# Altium schematic sheet CH32M030C8T7_1V3.SchDoc
size C
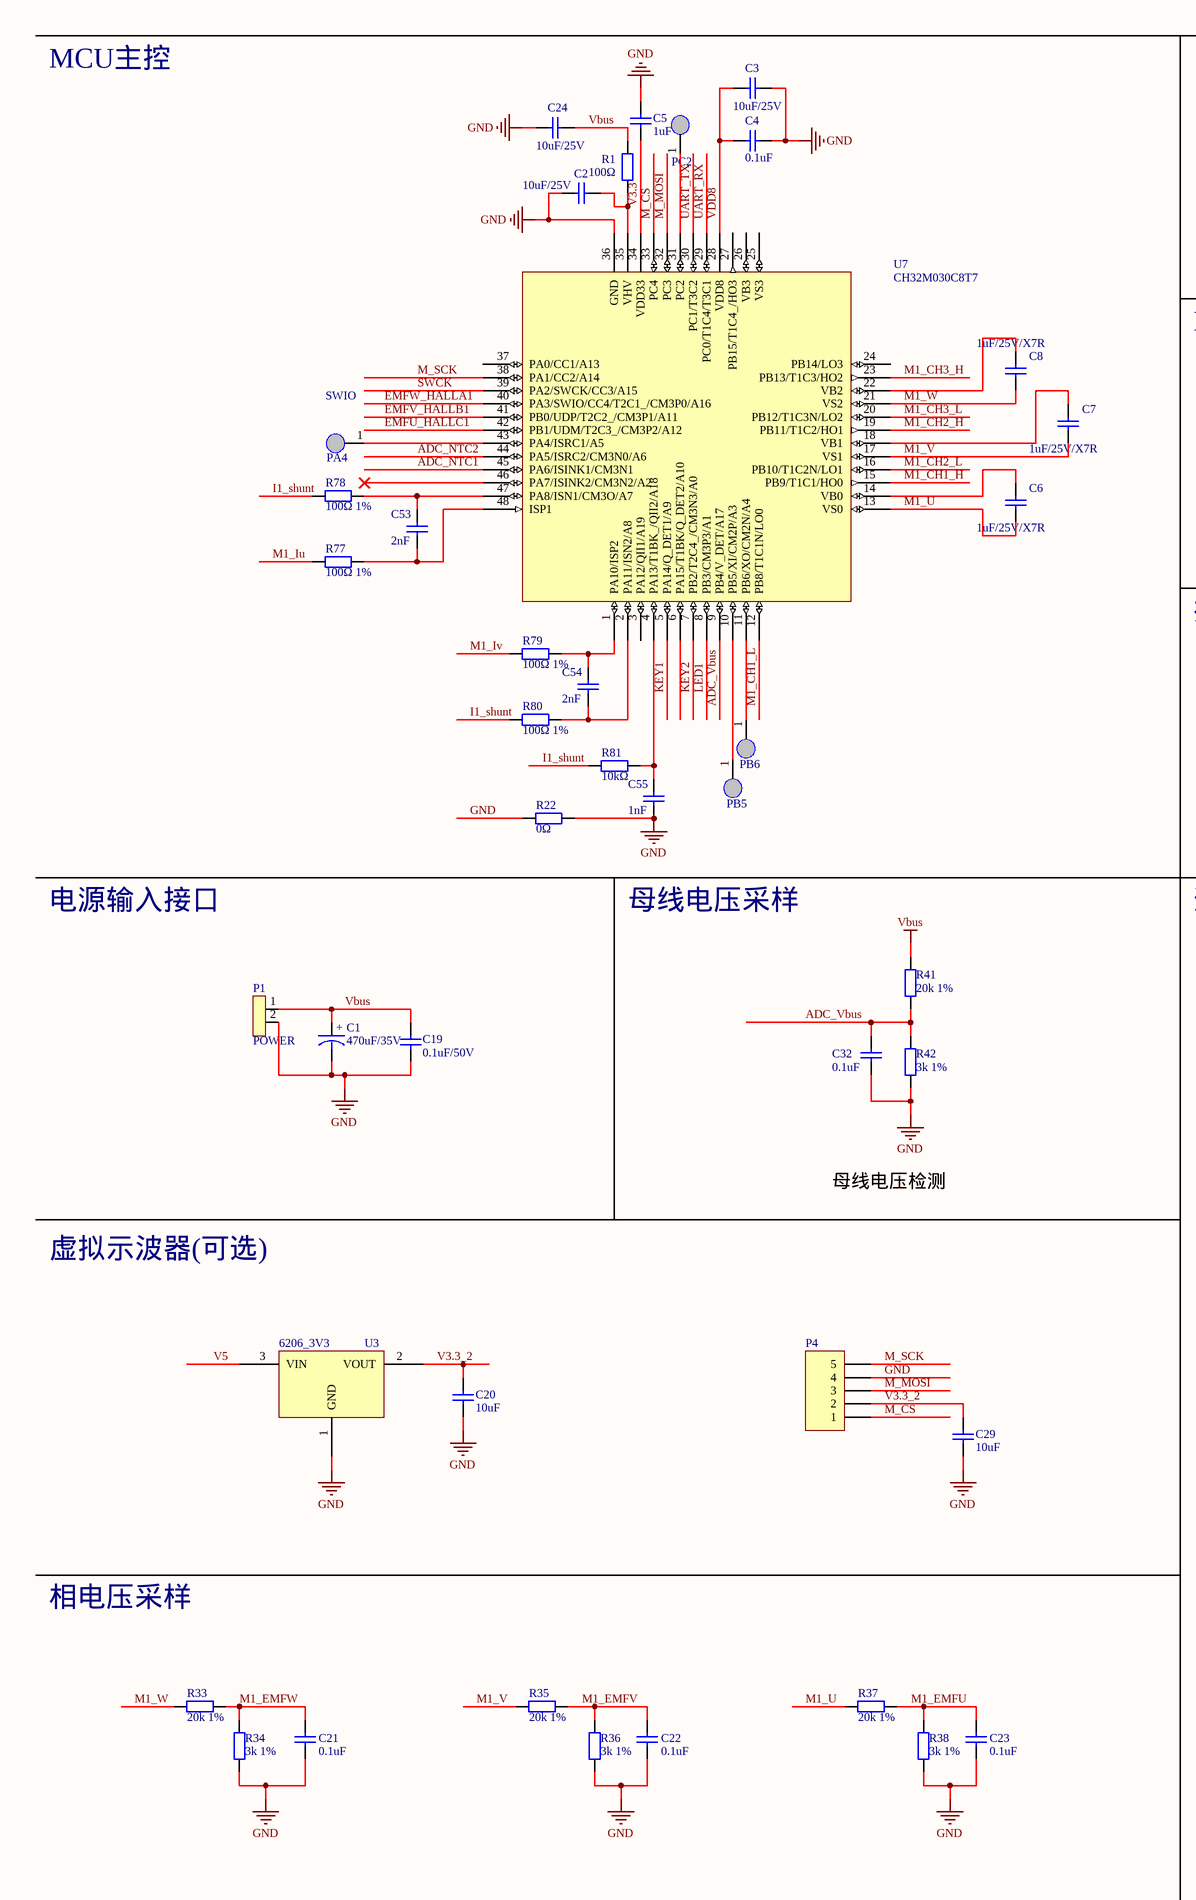
[diagram p0: CH32M030C8T7_1V3.SchDoc, left]
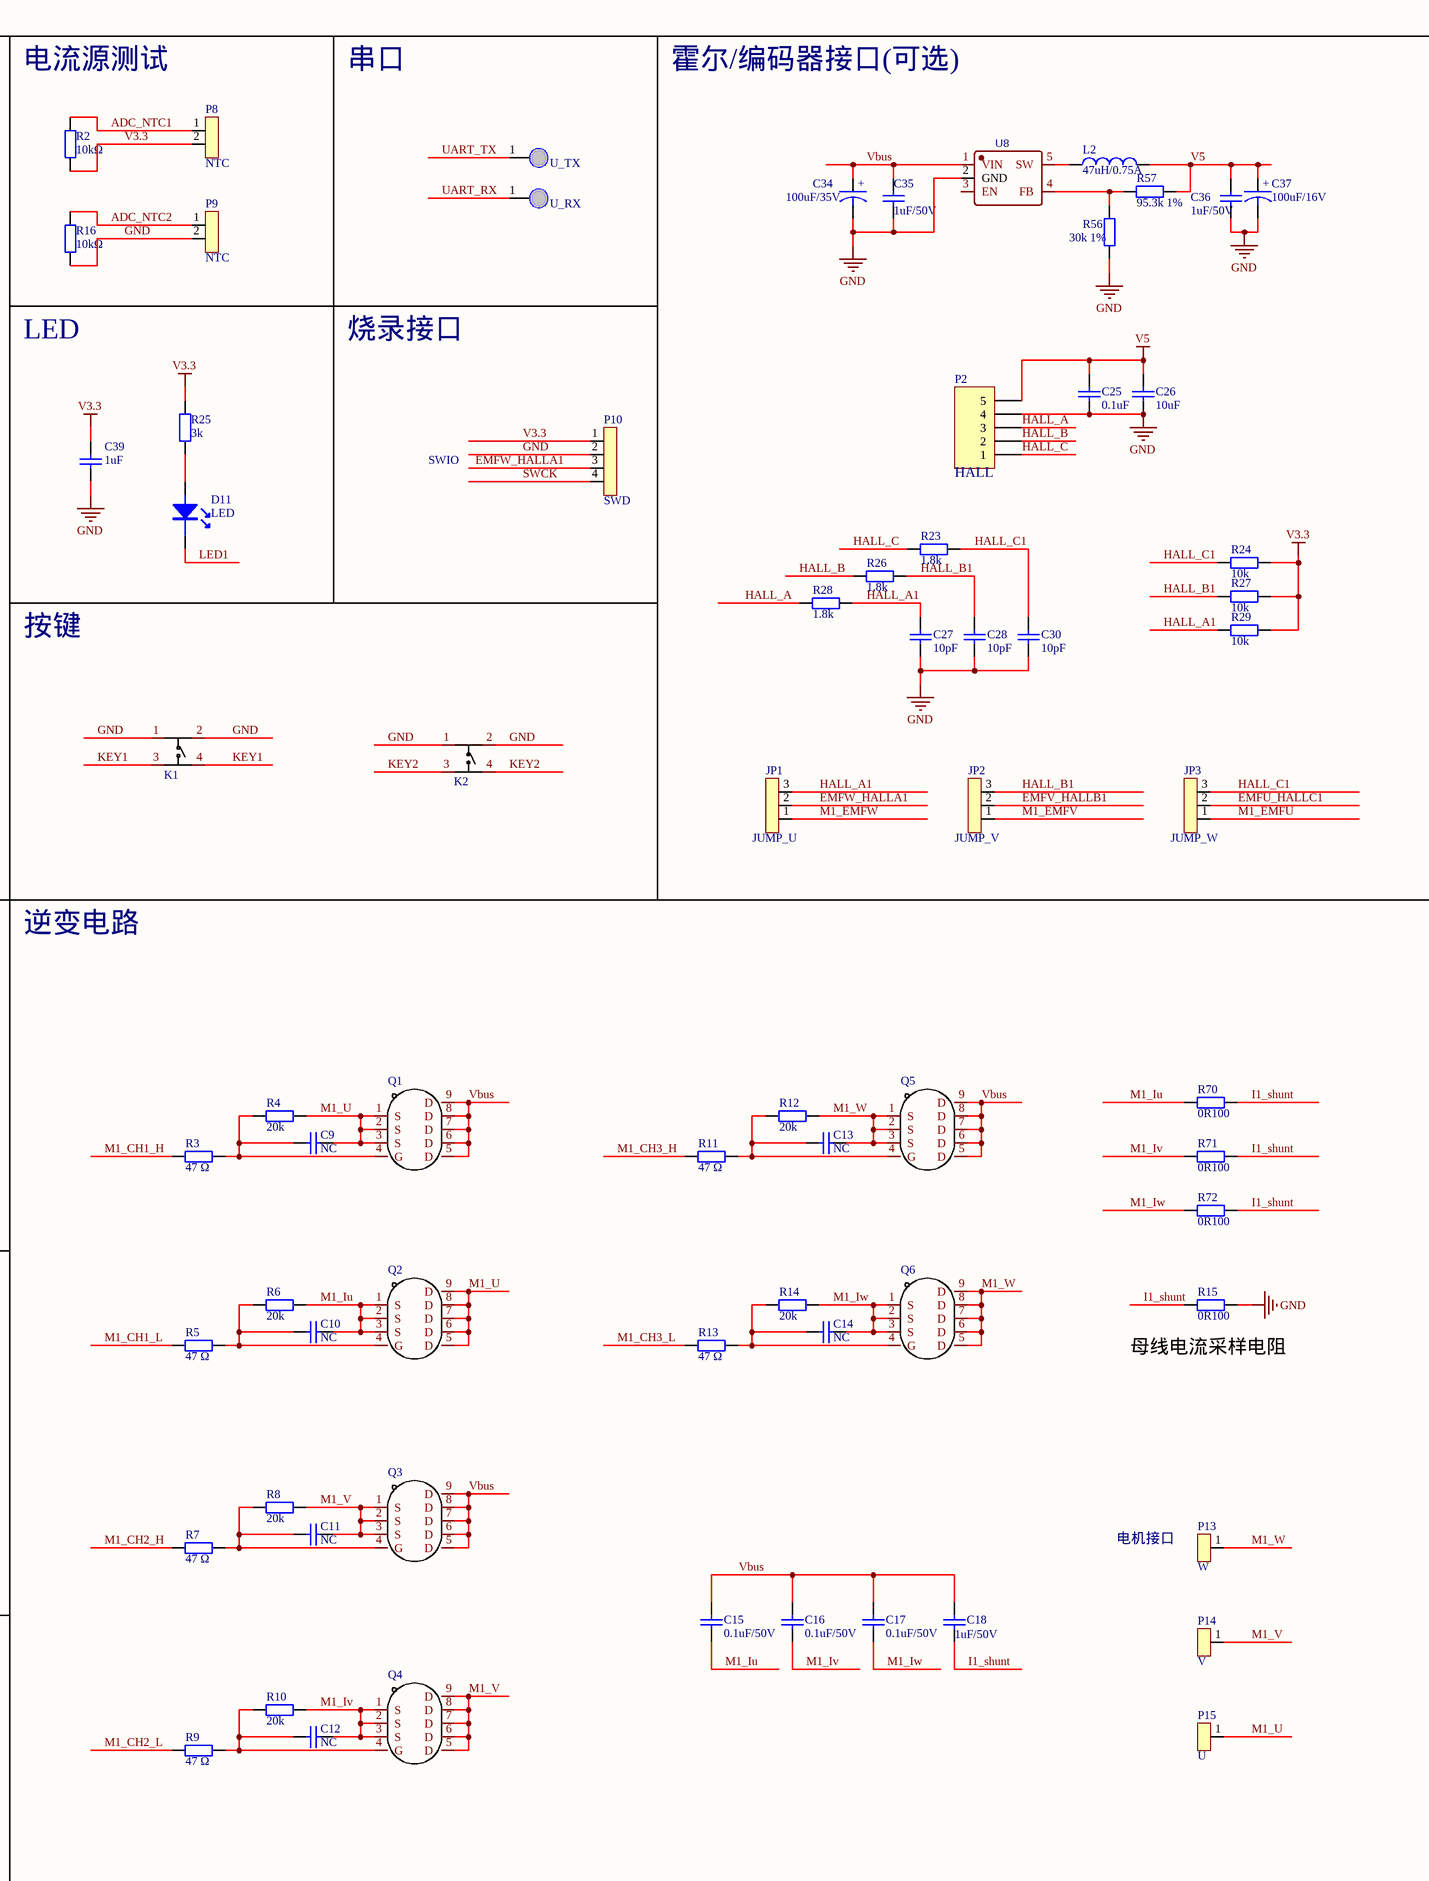
[diagram p1: CH32M030C8T7_1V3.SchDoc, right]

## Parts
C1  470uF/35V  [M_C_RB_D10F5]
C2  10uF/25V  [M_C0805-]
C3  10uF/25V  [M_C0805-]
C4  0.1uF  [M_C0402-]
C5  1uF  [M_C0603]
C6  1uF/25V/X7R  [M_C0805]
C7  1uF/25V/X7R  [M_C0805]
C8  1uF/25V/X7R  [M_C0805]
C9  NC  [M_C0402-]
C10  NC  [M_C0402-]
C11  NC  [M_C0402-]
C12  NC  [M_C0402-]
C13  NC  [M_C0402-]
C14  NC  [M_C0402-]
C15  0.1uF/50V  [M_C0402-]
C16  0.1uF/50V  [M_C0402-]
C17  0.1uF/50V  [M_C0402-]
C18  1uF/50V  [M_C0805-]
C19  0.1uF/50V  [M_C0402-]
C20  10uF  [M_C0603]
C21  0.1uF  [M_C0402-]
C22  0.1uF  [M_C0402-]
C23  0.1uF  [M_C0402-]
C24  10uF/25V  [M_C0805-]
C25  0.1uF  [0603]
C26  10uF  [0603]
C27  10pF  [0603]
C28  10pF  [0603]
C29  10uF  [M_C0603]
C30  10pF  [0603]
C32  0.1uF  [M_C0402-]
C34  100uF/35V  [M_C_RB4/2_D6.3]
C35  1uF/50V  [M_C0603]
C36  1uF/50V  [M_C0603]
C37  100uF/16V  [M_C_RB4/2_D6.3]
C39  1uF  [M_C0603]
C53  2nF  [M_C0402-]
C54  2nF  [M_C0402-]
C55  1nF  [M_C0402-]
D11  LED  [LED-0603]
JP1  JUMP_U  [M_JUMP-3]
JP2  JUMP_V  [M_JUMP-3]
JP3  JUMP_W  [M_JUMP-3]
K1  KH-6X6X8H-STM  [KEY2-SMD]  (value not drawn)
K2  KH-6X6X8H-STM  [KEY2-SMD]  (value not drawn)
L2  47uH  [SMD4030]  (value not drawn)
P1  POWER  [WJ15EDGRC3.81-2]
P2  Header 5  [2510-5]  (value not drawn)
P4  HEADER 5  [HDR2.54-LI-5P]  (value not drawn)
P8  NTC  [GH1.25-2P]
P9  NTC  [GH1.25-2P]
P10  SWD  [HDR2.54-LI-4P]
P13  W  [M_PAD-2.4/3.7]
P14  V  [M_PAD-2.4/3.7]
P15  U  [M_PAD-2.4/3.7]
PA4  Testpoint  [TEST-1.2]  (value not drawn)
PB5  Testpoint  [TEST-1.2]  (value not drawn)
PB6  Testpoint  [TEST-1.2]  (value not drawn)
PC2  Testpoint  [TEST-1.2]  (value not drawn)
Q1  (no value)  [M_PDFN-8_L5.8-W4.9]
Q2  (no value)  [M_PDFN-8_L5.8-W4.9]
Q3  (no value)  [M_PDFN-8_L5.8-W4.9]
Q4  (no value)  [M_PDFN-8_L5.8-W4.9]
Q5  (no value)  [M_PDFN-8_L5.8-W4.9]
Q6  (no value)  [M_PDFN-8_L5.8-W4.9]
R1  100Ω  [M_R1206-]
R2  10kΩ  [M_R0402-]
R3  47 Ω  [M_R0402-]
R4  20k  [M_R0402-]
R5  47 Ω  [M_R0402-]
R6  20k  [M_R0402-]
R7  47 Ω  [M_R0402-]
R8  20k  [M_R0402-]
R9  47 Ω  [M_R0402-]
R10  20k  [M_R0402-]
R11  47 Ω  [M_R0402-]
R12  20k  [M_R0402-]
R13  47 Ω  [M_R0402-]
R14  20k  [M_R0402-]
R15  0R100  [M_R2512]
R16  10kΩ  [M_R0402-]
R22  0Ω  [M_R0402-]
R23  1.8k  [0603]
R24  10k  [M_R0402-]
R25  3k  [M_R0402-]
R26  1.8k  [0603]
R27  10k  [M_R0402-]
R28  1.8k  [0603]
R29  10k  [M_R0402-]
R33  20k 1%  [M_R0603]
R34  3k 1%  [M_R0402-]
R35  20k 1%  [M_R0603]
R36  3k 1%  [M_R0402-]
R37  20k 1%  [M_R0603]
R38  3k 1%  [M_R0402-]
R41  20k 1%  [M_R0603]
R42  3k 1%  [M_R0402-]
R56  30k 1%  [M_R0402-]
R57  95.3k 1%  [M_R0402-]
R70  0R100  [M_R2512]
R71  0R100  [M_R2512]
R72  0R100  [M_R2512]
R77  100Ω 1%  [M_R0402-]
R78  100Ω 1%  [M_R0402-]
R79  100Ω 1%  [M_R0402-]
R80  100Ω 1%  [M_R0402-]
R81  10kΩ  [M_R0402-]
U3  6206_3V3  [SOT-23]
U7  CH32M030C8T7  [LQFP48]
U8  (no value)  [SOT23-5]
U_RX  Testpoint  [TEST-1.2]  (value not drawn)
U_TX  Testpoint  [TEST-1.2]  (value not drawn)

## Nets
GND: C1.2 C2.1 C3.1 C4.2 C5.2 C19.2 C20.1 C21.2 C22.2 C23.2 C24.1 C25.2 C26.2 C27.2 C28.2 C29.2 C30.2 C32.2 C34.2 C35.2 C36.2 C37.2 C39.2 C55.2 K1.1(A) K1.2(B) K2.1(A) K2.2(B) P1.2 P2.4 P4.4 P9.2 P10.2 R15.1 R16.1 R22.1 R22.2 R34.1 R36.1 R38.1 R42.1 R56.1 U3.1(GND) U7.36(GND) U8.2(GND)
V3.3: C5.1 C39.1 P8.2 P10.1 R2.1 R24.1 R25.2 R27.1 R29.1 U7.34(VDD33)
V5: C25.1 C26.1 C36.1 C37.1 L2.2 P2.5 R57.2 U3.3(VIN)
Vbus: C1.1 C15.1 C16.1 C17.1 C18.1 C19.1 C24.2 C34.1 C35.1 P1.1 Q1.5(D) Q1.6(D) Q1.7(D) Q1.8(D) Q1.9(D) Q3.5(D) Q3.6(D) Q3.7(D) Q3.8(D) Q3.9(D) Q5.5(D) Q5.6(D) Q5.7(D) Q5.8(D) Q5.9(D) R1.2 R41.2 U8.1(VIN)
ADC_NTC1: P8.1 R2.2 U7.45(PA6/ISINK1/CM3N1)
ADC_NTC2: P9.1 R16.2 U7.44(PA5/ISRC2/CM3N0/A6)
ADC_Vbus: C32.1 R41.1 R42.2 U7.9(PB4/V_DET/A17)
EMFU_HALLC1: JP3.2 U7.42(PB1/UDM/T2C3_/CM3P2/A12)
EMFV_HALLB1: JP2.2 U7.41(PB0/UDP/T2C2_/CM3P1/A11)
EMFW_HALLA1: JP1.2 P10.3 U7.40(PA3/SWIO/CC4/T2C1_/CM3P0/A16)
HALL_A: P2.3 R28.1
HALL_A1: C27.1 JP1.3 R28.2 R29.2
HALL_B: P2.2 R26.1
HALL_B1: C28.1 JP2.3 R26.2 R27.2
HALL_C: P2.1 R23.1
HALL_C1: C30.1 JP3.3 R23.2 R24.2
I1_shunt: C18.2 R15.2 R70.1 R71.1 R72.1 R78.1 R80.1 R81.1
KEY1: K1.3(C) K1.4(D) U7.5(PA14/Q_DET1/A9)
KEY2: K2.3(C) K2.4(D) U7.7(PB2/T2C4_/CM3N3/A0)
LED1: D11.2(K) U7.8(PB3/CM3P3/A1)
M1_CH1_H: R3.2 U7.15(PB9/T1C1/HO0)
M1_CH1_L: R5.2 U7.12(PB8/T1C1N/LO0)
M1_CH2_H: R7.2 U7.19(PB11/T1C2/HO1)
M1_CH2_L: R9.2 U7.16(PB10/T1C2N/LO1)
M1_CH3_H: R11.2 U7.23(PB13/T1C3/HO2)
M1_CH3_L: R13.2 U7.20(PB12/T1C3N/LO2)
M1_EMFU: C23.1 JP3.1 R37.1 R38.2
M1_EMFV: C22.1 JP2.1 R35.1 R36.2
M1_EMFW: C21.1 JP1.1 R33.1 R34.2
M1_Iu: C10.2 C15.2 Q2.1(S) Q2.2(S) Q2.3(S) R6.1 R70.2 R77.1
M1_Iv: C12.2 C16.2 Q4.1(S) Q4.2(S) Q4.3(S) R10.1 R71.2 R79.1
M1_Iw: C14.2 C17.2 Q6.1(S) Q6.2(S) Q6.3(S) R14.1 R72.2
M1_U: C6.2 C9.2 P15.1 Q1.1(S) Q1.2(S) Q1.3(S) Q2.5(D) Q2.6(D) Q2.7(D) Q2.8(D) Q2.9(D) R4.1 R37.2 U7.13(VS0)
M1_V: C7.2 C11.2 P14.1 Q3.1(S) Q3.2(S) Q3.3(S) Q4.5(D) Q4.6(D) Q4.7(D) Q4.8(D) Q4.9(D) R8.1 R35.2 U7.17(VS1)
M1_W: C8.2 C13.2 P13.1 Q5.1(S) Q5.2(S) Q5.3(S) Q6.5(D) Q6.6(D) Q6.7(D) Q6.8(D) Q6.9(D) R12.1 R33.2 U7.21(VS2)
M_CS: P4.1 U7.33(PC4)
M_MOSI: P4.3 U7.32(PC3)
M_SCK: P4.5 U7.38(PA1/CC2/A14)
SWCK: P10.4 U7.39(PA2/SWCK/CC3/A15)
UART_RX: U7.29(PC0/T1C4/T3C1) U_RX.1
UART_TX: U7.30(PC1/T3C2) U_TX.1
V3.3_2: C20.2 C29.1 P4.2 U3.2(VOUT)
VDD8: C3.2 C4.1 U7.28(VDD8)
NetC2_2: C2.2 R1.1 U7.35(VHV)
NetC6_1: C6.1 U7.14(VB0)
NetC7_1: C7.1 U7.18(VB1)
NetC8_1: C8.1 U7.22(VB2)
NetC9_1: C9.1 Q1.4(G) R3.1 R4.2
NetC10_1: C10.1 Q2.4(G) R5.1 R6.2
NetC11_1: C11.1 Q3.4(G) R7.1 R8.2
NetC12_1: C12.1 Q4.4(G) R9.1 R10.2
NetC13_1: C13.1 Q5.4(G) R11.1 R12.2
NetC14_1: C14.1 Q6.4(G) R13.1 R14.2
NetC53_1: C53.1 R78.2 U7.47(PA8/ISN1/CM3O/A7)
NetC53_2: C53.2 R77.2 U7.48(ISP1)
NetC54_1: C54.1 R79.2 U7.1(PA10/ISP2)
NetC54_2: C54.2 R80.2 U7.2(PA11/ISN2/A8)
NetC55_1: C55.1 R81.2 U7.4(PA13/T1BK_/QII2/A18)
NetD11_1: D11.1(A) R25.1
NetL2_1: L2.1 U8.5(SW)
NetPA4_1: PA4.1 U7.43(PA4/ISRC1/A5)
NetPB5_1: PB5.1 U7.10(PB5/XI/CM2P/A3)
NetPB6_1: PB6.1 U7.11(PB6/XO/CM2N/A4)
NetPC2_1: PC2.1 U7.31(PC2)
NetR56_2: R56.2 R57.1 U8.4(FB)

Not connected (* = marked no-connect by the designer): U7 3(PA12/QII1/A19) 6(PA15/T1BK/Q_DET2/A10) 24(PB14/LO3) 25(VS3) 26(VB3) 27(PB15/T1C4_/HO3) 37(PA0/CC1/A13) 46(PA7/ISINK2/CM3N2/A2)*; U8 3(EN)

## Notes on the sheet
- MCU主控
- 电流源测试
- 串口
- 霍尔/编码器接口(可选)
- LED
- 烧录接口
- (near PA4) SWIO
- SWIO
- (near P2) HALL
- 按键
- 电源输入接口
- 母线电压采样
- 逆变电路
- 母线电压检测
- 虚拟示波器(可选)
- (near R15) 母线电流采样电阻
- 电机接口
- 相电压采样
- (in symbol CAPACITOR POL_2) +
- (in symbol INDUCTOR) 47uH/0.75A

## Library data of the parts
C1 C34 C37 = CAPACITOR POL_2: Capacitor
  C1: Value: 470uF/35V
  C34: Value: 100uF/35V
  C37: Value: 100uF/16V
C2-C30 C32 C35 C36 C39 C53-C55 = Cap Semi: Capacitor (Semiconductor SIM Model); Published: 8-Jun-2000; LatestRevisionDate: 17-Jul-2002; LatestRevisionNote: Re-released for DXP Platform.; PackageReference: C0805; Publisher: Altium Limited
  C2 C3 C24: Value: 10uF/25V
  C4 C21-C23 C25 C32: Value: 0.1uF
  C5 C39: Value: 1uF
  C6-C8: Value: 1uF/25V/X7R
  C9-C14: Value: NC
  C15-C17 C19: Value: 0.1uF/50V
  C18 C35 C36: Value: 1uF/50V
  C20 C26 C29: Value: 10uF
  C27 C28 C30: Value: 10pF
  C53 C54: Value: 2nF
  C55: Value: 1nF
JP1-JP3 = 3PIN
K1 K2 = KH-6X6X8H-STM: Add into BOM: yes; Contact Current: 50mA; Voltage Rating (DC): 12V; Mechanical Life: 80000; Switch Length: 6mm; Name: KH-6X6X8H-STM; Symbol: KH-6X6X8H-STM; Device: KH-6X6X8H-STM; LCSC Part Name: KH-6X6X8H-STM; Supplier Part: C2837534; Manufacturer Part: KH-6X6X8H-STM; Supplier Footprint: SMD; JLCPCB Part Class: Extended Part; Datasheet: https://atta.szlcsc.com/upload/public/pdf/source/20210608/C2837534_94EAC7D8AFBB996E2814FACF50FEEF85.pdf; Supplier: LCSC; Convert to PCB: yes; Voltage Rating (AC): -; Power Rating: -; With Lamp: -; Operating Force: -; Operating Temperature: -; IP Rating: -; Switch Width: 6mm; Switch Height: -
L2 = INDUCTOR
P1 P8 P9 = 2PIN
P2 = Header 5: Header, 5-Pin; LatestRevisionDate: 17-Jul-2002; LatestRevisionNote: Re-released for DXP Platform.; Publisher: Altium Limited
P4 = HEADER 5: Header, 5-Pin
P10 = 4PIN
P13-P15 = 1PIN: CONNECTOR
PA4 PB5 PB6 PC2 U_RX U_TX = Testpoint: 测试点
Q1-Q6 = NP100N03D6: Add into BOM: yes; Symbol: NP100N03D6; Device: NP100N03D6; LCSC Part Name: NP100N03D6; Supplier Part: C2991148; Manufacturer Part: NP100N03D6; Supplier Footprint: PDFN-8(5x5.8); JLCPCB Part Class: Extended Part; Datasheet: https://atta.szlcsc.com/upload/public/pdf/source/20220426/E6C9656FCA27A34FA1A0E072B57224E0.pdf; Supplier: LCSC; Convert to PCB: yes
R1-R16 R22-R29 R33-R38 R41 R42 R56 R57 R70-R72 R77-R81 = Res2: Resistor; Published: 8-Jun-2000; LatestRevisionDate: 17-Jul-2002; LatestRevisionNote: Re-released for DXP Platform.; PackageReference: AXIAL-0.4; Publisher: Altium Limited
  R1: Value: 100Ω
  R2 R16 R81: Value: 10kΩ
  R3 R5 R7 R9 R11 R13: Value: 47 Ω
  R4 R6 R8 R10 R12 R14: Value: 20k
  R15 R70-R72: Value: 0R100
  R22: Value: 0Ω
  R23 R26 R28: Value: 1.8k
  R24 R27 R29: Value: 10k
  R25: Value: 3k
  R33 R35 R37 R41: Value: 20k 1%
  R34 R36 R38 R42: Value: 3k 1%
  R56: Value: 30k 1%
  R57: Value: 95.3k 1%
  R77-R80: Value: 100Ω 1%
U3 = LM1117_3.3V
U7 = CH32M030C8T7: RISC-V MCU, 72MHz, USB, Type-C/PD, OPA, CMP, 28V gate driver
U8 = AP2900TB-A1: Contributor: LCSC; BOM_Supplier: LCSC; BOM_Supplier Part: C2930954; BOM_Manufacturer Part: AP2900TB-A1; spicePre: U; spiceSymbolName: AP2900TB-A1